# Altium schematic sheet ETH.SchDoc
size 381 x 241 mm; SheetNumber: 2; SheetTotal: 3
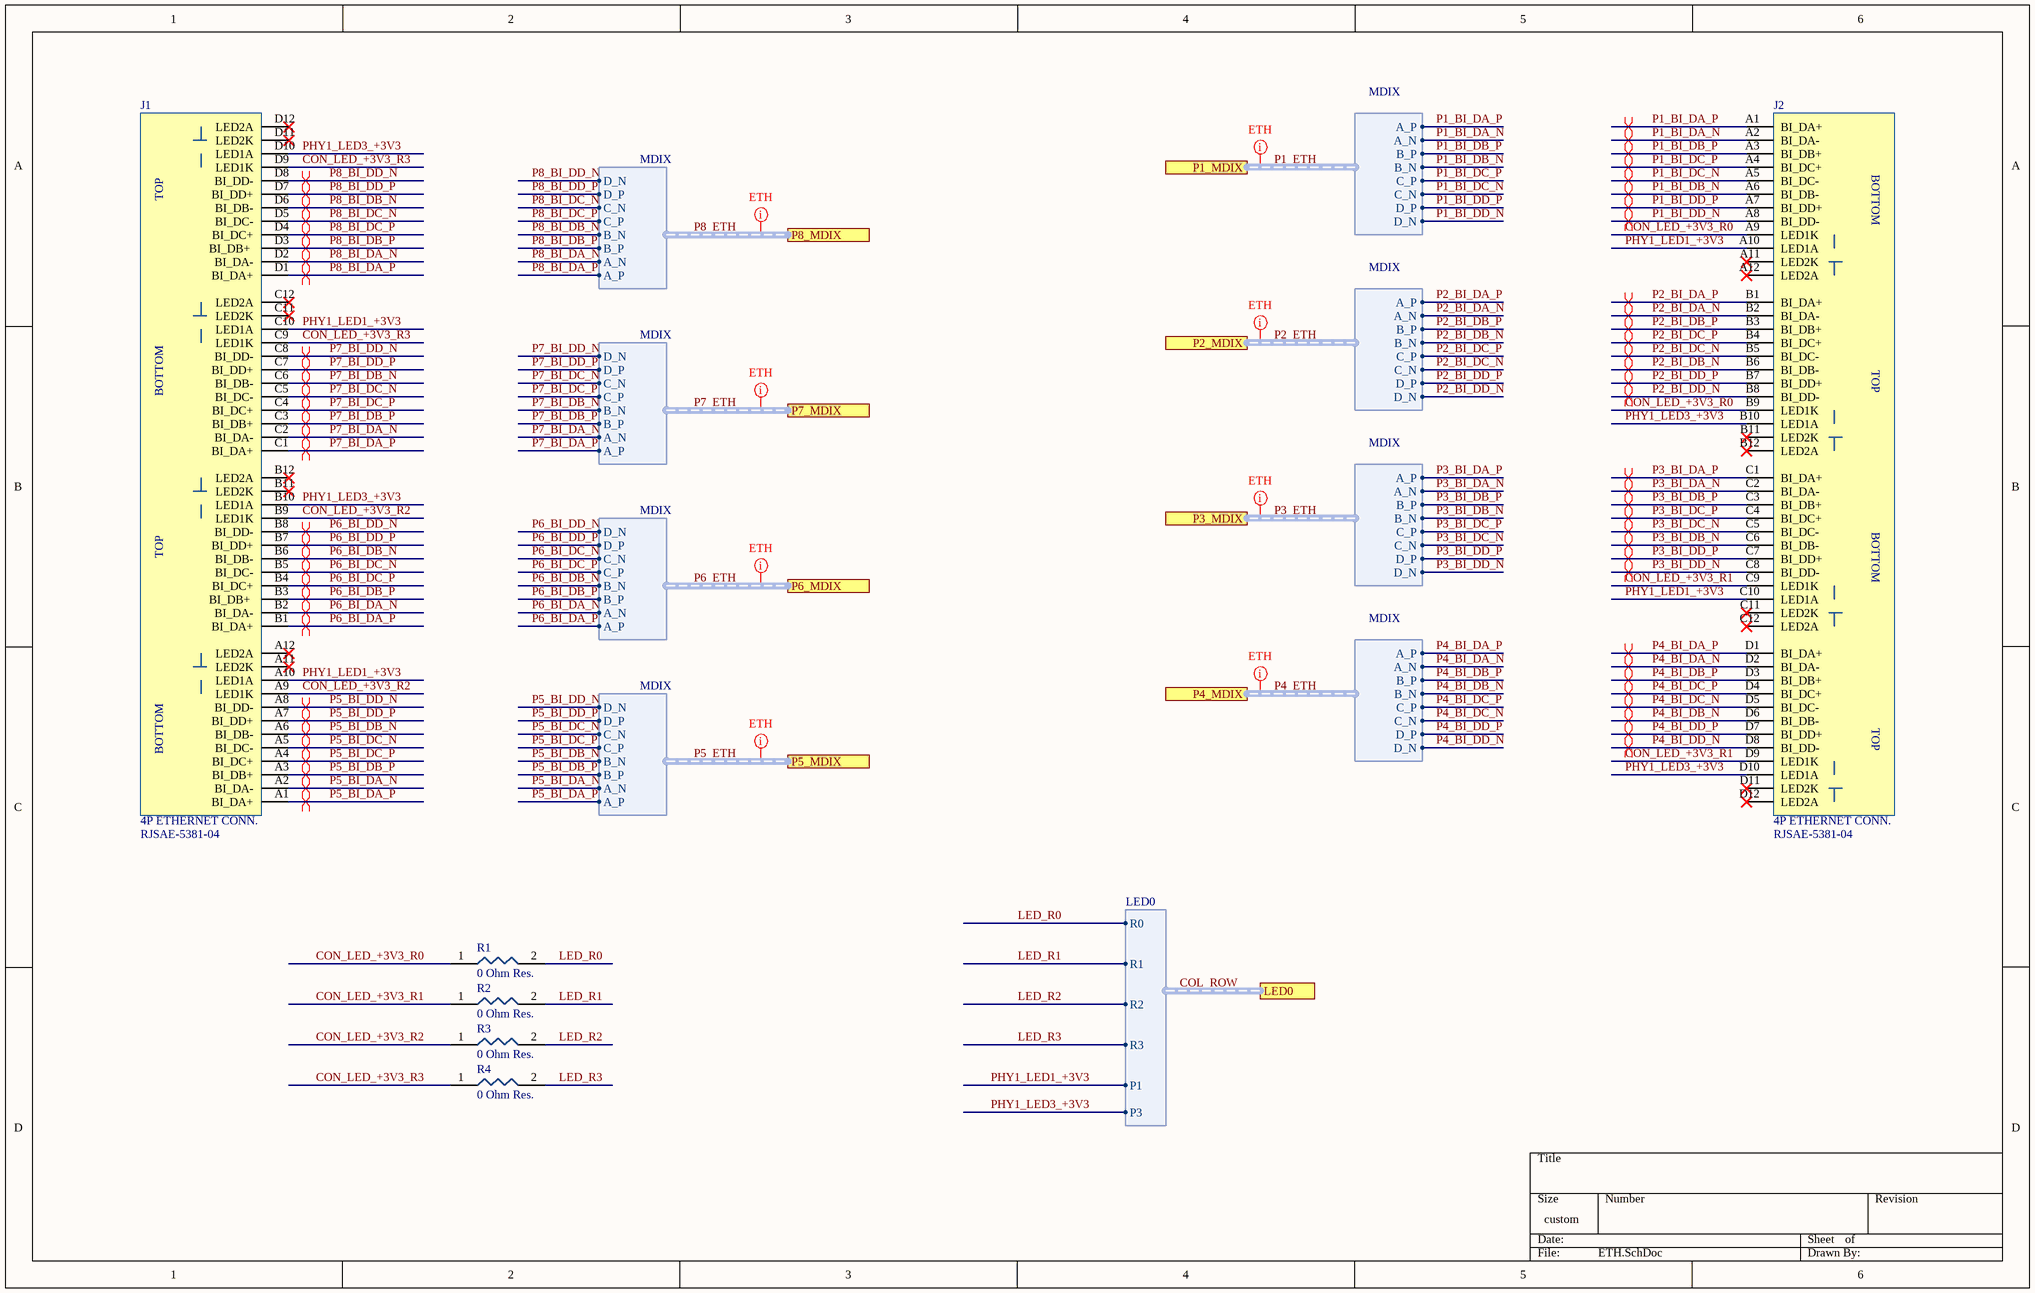
[diagram p0: ETH.SchDoc]

## Parts
J1  4P ETHERNET CONN.  Order Number: RJSAE-5381-04  [4P Ethernet CONN.]
J2  4P ETHERNET CONN.  Order Number: RJSAE-5381-04  [4P Ethernet CONN.]
R1  0 Ohm Res.  [0 Ohm Res.]
R2  0 Ohm Res.  [0 Ohm Res.]
R3  0 Ohm Res.  [0 Ohm Res.]
R4  0 Ohm Res.  [0 Ohm Res.]

## Ports
LED0 (harness LED0), P1_MDIX (harness MDIX), P2_MDIX (harness MDIX), P3_MDIX (harness MDIX), P4_MDIX (harness MDIX), P5_MDIX (harness MDIX), P6_MDIX (harness MDIX), P7_MDIX (harness MDIX), P8_MDIX (harness MDIX)

## Harnesses
MDIX: A_P, A_N, B_P, B_N, C_N, D_P, D_N, C_P
LED0: R0, R1, R2, R3, P1, P3

## Nets
CON_LED_+3V3_R0: J2.A9(LED1K) J2.B9(LED1K) R1.1
CON_LED_+3V3_R1: J2.C9(LED1K) J2.D9(LED1K) R2.1
CON_LED_+3V3_R2: J1.A9(LED1K) J1.B9(LED1K) R3.1
CON_LED_+3V3_R3: J1.C9(LED1K) J1.D9(LED1K) R4.1
LED_R0: R1.2 ; port LED0.R0  [project net COL_ROW.R0]
LED_R1: R2.2 ; port LED0.R1  [project net COL_ROW.R1]
LED_R2: R3.2 ; port LED0.R2  [project net COL_ROW.R2]
LED_R3: R4.2 ; port LED0.R3  [project net COL_ROW.R3]
P1_BI_DA_N: J2.A2(BI_DA-) ; port P1_MDIX.A_N
P1_BI_DA_P: J2.A1(BI_DA+) ; port P1_MDIX.A_P
P1_BI_DB_N: J2.A6(BI_DB-) ; port P1_MDIX.B_N
P1_BI_DB_P: J2.A3(BI_DB+) ; port P1_MDIX.B_P
P1_BI_DC_N: J2.A5(BI_DC-) ; port P1_MDIX.C_N
P1_BI_DC_P: J2.A4(BI_DC+) ; port P1_MDIX.C_P
P1_BI_DD_N: J2.A8(BI_DD-) ; port P1_MDIX.D_N
P1_BI_DD_P: J2.A7(BI_DD+) ; port P1_MDIX.D_P
P2_BI_DA_N: J2.B2(BI_DA-) ; port P2_MDIX.A_N
P2_BI_DA_P: J2.B1(BI_DA+) ; port P2_MDIX.A_P
P2_BI_DB_N: J2.B6(BI_DB-) ; port P2_MDIX.B_N
P2_BI_DB_P: J2.B3(BI_DB+) ; port P2_MDIX.B_P
P2_BI_DC_N: J2.B5(BI_DC-) ; port P2_MDIX.C_N
P2_BI_DC_P: J2.B4(BI_DC+) ; port P2_MDIX.C_P
P2_BI_DD_N: J2.B8(BI_DD-) ; port P2_MDIX.D_N
P2_BI_DD_P: J2.B7(BI_DD+) ; port P2_MDIX.D_P
P3_BI_DA_N: J2.C2(BI_DA-) ; port P3_MDIX.A_N
P3_BI_DA_P: J2.C1(BI_DA+) ; port P3_MDIX.A_P
P3_BI_DB_N: J2.C6(BI_DB-) ; port P3_MDIX.B_N
P3_BI_DB_P: J2.C3(BI_DB+) ; port P3_MDIX.B_P
P3_BI_DC_N: J2.C5(BI_DC-) ; port P3_MDIX.C_N
P3_BI_DC_P: J2.C4(BI_DC+) ; port P3_MDIX.C_P
P3_BI_DD_N: J2.C8(BI_DD-) ; port P3_MDIX.D_N
P3_BI_DD_P: J2.C7(BI_DD+) ; port P3_MDIX.D_P
P4_BI_DA_N: J2.D2(BI_DA-) ; port P4_MDIX.A_N
P4_BI_DA_P: J2.D1(BI_DA+) ; port P4_MDIX.A_P
P4_BI_DB_N: J2.D6(BI_DB-) ; port P4_MDIX.B_N
P4_BI_DB_P: J2.D3(BI_DB+) ; port P4_MDIX.B_P
P4_BI_DC_N: J2.D5(BI_DC-) ; port P4_MDIX.C_N
P4_BI_DC_P: J2.D4(BI_DC+) ; port P4_MDIX.C_P
P4_BI_DD_N: J2.D8(BI_DD-) ; port P4_MDIX.D_N
P4_BI_DD_P: J2.D7(BI_DD+) ; port P4_MDIX.D_P
P5_BI_DA_N: J1.A2(BI_DA-) ; port P5_MDIX.A_N
P5_BI_DA_P: J1.A1(BI_DA+) ; port P5_MDIX.A_P
P5_BI_DB_N: J1.A6(BI_DB-) ; port P5_MDIX.B_N
P5_BI_DB_P: J1.A3(BI_DB+) ; port P5_MDIX.B_P
P5_BI_DC_N: J1.A5(BI_DC-) ; port P5_MDIX.C_N
P5_BI_DC_P: J1.A4(BI_DC+) ; port P5_MDIX.C_P
P5_BI_DD_N: J1.A8(BI_DD-) ; port P5_MDIX.D_N
P5_BI_DD_P: J1.A7(BI_DD+) ; port P5_MDIX.D_P
P6_BI_DA_N: J1.B2(BI_DA-) ; port P6_MDIX.A_N
P6_BI_DA_P: J1.B1(BI_DA+) ; port P6_MDIX.A_P
P6_BI_DB_N: J1.B6(BI_DB-) ; port P6_MDIX.B_N
P6_BI_DB_P: J1.B3(BI_DB+) ; port P6_MDIX.B_P
P6_BI_DC_N: J1.B5(BI_DC-) ; port P6_MDIX.C_N
P6_BI_DC_P: J1.B4(BI_DC+) ; port P6_MDIX.C_P
P6_BI_DD_N: J1.B8(BI_DD-) ; port P6_MDIX.D_N
P6_BI_DD_P: J1.B7(BI_DD+) ; port P6_MDIX.D_P
P7_BI_DA_N: J1.C2(BI_DA-) ; port P7_MDIX.A_N
P7_BI_DA_P: J1.C1(BI_DA+) ; port P7_MDIX.A_P
P7_BI_DB_N: J1.C6(BI_DB-) ; port P7_MDIX.B_N
P7_BI_DB_P: J1.C3(BI_DB+) ; port P7_MDIX.B_P
P7_BI_DC_N: J1.C5(BI_DC-) ; port P7_MDIX.C_N
P7_BI_DC_P: J1.C4(BI_DC+) ; port P7_MDIX.C_P
P7_BI_DD_N: J1.C8(BI_DD-) ; port P7_MDIX.D_N
P7_BI_DD_P: J1.C7(BI_DD+) ; port P7_MDIX.D_P
P8_BI_DA_N: J1.D2(BI_DA-) ; port P8_MDIX.A_N
P8_BI_DA_P: J1.D1(BI_DA+) ; port P8_MDIX.A_P
P8_BI_DB_N: J1.D6(BI_DB-) ; port P8_MDIX.B_N
P8_BI_DB_P: J1.D3(BI_DB+) ; port P8_MDIX.B_P
P8_BI_DC_N: J1.D5(BI_DC-) ; port P8_MDIX.C_N
P8_BI_DC_P: J1.D4(BI_DC+) ; port P8_MDIX.C_P
P8_BI_DD_N: J1.D8(BI_DD-) ; port P8_MDIX.D_N
P8_BI_DD_P: J1.D7(BI_DD+) ; port P8_MDIX.D_P
PHY1_LED1_+3V3: J1.A10(LED1A) J1.C10(LED1A) J2.A10(LED1A) J2.C10(LED1A) ; port LED0.P1  [project net COL_ROW.P1]
PHY1_LED3_+3V3: J1.B10(LED1A) J1.D10(LED1A) J2.B10(LED1A) J2.D10(LED1A) ; port LED0.P3  [project net COL_ROW.P3]

Not connected (* = marked no-connect by the designer): J1 A11(LED2K)* A12(LED2A)* B11(LED2K)* B12(LED2A)* C11(LED2K)* C12(LED2A)* D11(LED2K)* D12(LED2A)*; J2 A11(LED2K)* A12(LED2A)* B11(LED2K)* B12(LED2A)* C11(LED2K)* C12(LED2A)* D11(LED2K)* D12(LED2A)*

## Buses and harness runs
harness COL_ROW = port LED0
harness P1_ETH = port P1_MDIX
harness P2_ETH = port P2_MDIX
harness P3_ETH = port P3_MDIX
harness P4_ETH = port P4_MDIX
harness P5_ETH = port P5_MDIX
harness P6_ETH = port P6_MDIX
harness P7_ETH = port P7_MDIX
harness P8_ETH = port P8_MDIX

## Layout directives
differential pair: P1_BI_DA_N, P1_BI_DA_P, P1_BI_DB_N, P1_BI_DB_P, P1_BI_DC_N, P1_BI_DC_P, P1_BI_DD_N, P1_BI_DD_P, P2_BI_DA_N, P2_BI_DA_P, P2_BI_DB_N, P2_BI_DB_P, P2_BI_DC_N, P2_BI_DC_P, P2_BI_DD_N, P2_BI_DD_P, P3_BI_DA_N, P3_BI_DA_P, P3_BI_DB_N, P3_BI_DB_P, P3_BI_DC_N, P3_BI_DC_P, P3_BI_DD_N, P3_BI_DD_P, P4_BI_DA_N, P4_BI_DA_P, P4_BI_DB_N, P4_BI_DB_P, P4_BI_DC_N, P4_BI_DC_P, P4_BI_DD_N, P4_BI_DD_P, P5_BI_DA_N, P5_BI_DA_P, P5_BI_DB_N, P5_BI_DB_P, P5_BI_DC_N, P5_BI_DC_P, P5_BI_DD_N, P5_BI_DD_P, P6_BI_DA_N, P6_BI_DA_P, P6_BI_DB_N, P6_BI_DB_P, P6_BI_DC_N, P6_BI_DC_P, P6_BI_DD_N, P6_BI_DD_P, P7_BI_DA_N, P7_BI_DA_P, P7_BI_DB_N, P7_BI_DB_P, P7_BI_DC_N, P7_BI_DC_P, P7_BI_DD_N, P7_BI_DD_P, P8_BI_DA_N, P8_BI_DA_P, P8_BI_DB_N, P8_BI_DB_P, P8_BI_DC_N, P8_BI_DC_P, P8_BI_DD_N, P8_BI_DD_P
net class ETH: (no net found under the mark)

## Notes on the sheet
- (in symbol 4P ETHERNET CONN.) TOP; BOTTOM

## Library data of the parts
J1 J2 = 4P ETHERNET CONN.: Manufacturer: Amphenol ICC; Port Number: 4; Mounting Type: Through Hole; Price: $11.42
R1-R4 = 0 Ohm Res.: 0 Ohm Resistor; Manufacturer: Panasonic; Pin Number: 2; Order Number: ERJ-6GEY0R00V; Mounting Type: SMD; Price: $0.10